# Altium schematic sheet Expansor_conn.SchDoc
size A4; SheetNumber: 1; SheetTotal: 1
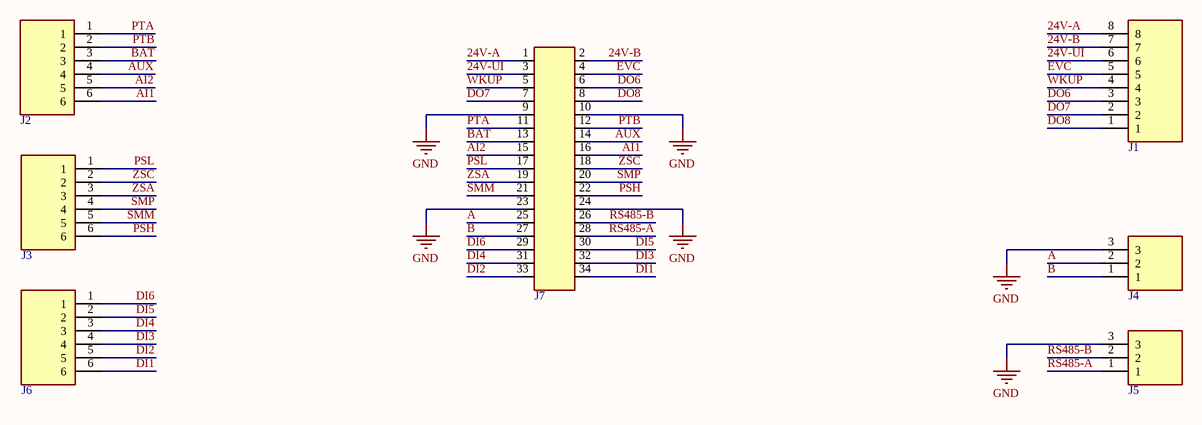
[diagram p0: Expansor_conn.SchDoc]

## Parts
J1  HDRF8  [HDR_F_1X8]  (value not drawn)
J2  HDRF6  [HDR_F_1X6]  (value not drawn)
J3  HDRF6  [HDR_F_1X6]  (value not drawn)
J4  HDRF3  [HDR_F_1X3]  (value not drawn)
J5  HDRF3  [HDR_F_1X3]  (value not drawn)
J6  HDRF6  [HDR_F_1X6]  (value not drawn)
J7  6120XX21621_61203421621  [61203421621]  (value not drawn)

## Nets
GND: J4.3 J5.3 J7.9 J7.10 J7.23 J7.24
24V-A: J1.8 J7.1
24V-B: J1.7 J7.2
24V-UI: J1.6 J7.3
A: J4.2 J7.25
AI1: J2.6 J7.16
AI2: J2.5 J7.15
AUX: J2.4 J7.14
B: J4.1 J7.27
BAT: J2.3 J7.13
DI1: J6.6 J7.34
DI2: J6.5 J7.33
DI3: J6.4 J7.32
DI4: J6.3 J7.31
DI5: J6.2 J7.30
DI6: J6.1 J7.29
DO6: J1.3 J7.6
DO7: J1.2 J7.7
DO8: J1.1 J7.8
EVC: J1.5 J7.4
PSH: J3.6 J7.22
PSL: J3.1 J7.17
PTA: J2.1 J7.11
PTB: J2.2 J7.12
RS485-A: J5.1 J7.28
RS485-B: J5.2 J7.26
SMM: J3.5 J7.21
SMP: J3.4 J7.20
WKUP: J1.4 J7.5
ZSA: J3.3 J7.19
ZSC: J3.2 J7.18

## Library data of the parts
J1 = Header Female 1x8 THT: CONN, HEADER, Female, pitch: 2.54mm, 8POS; VALUE: HDRF8
J2 J3 J6 = Header Female 1x6 THT: CONN, HEADER, Female, pitch: 2.54mm, 6POS; VALUE: HDRF6
J4 J5 = Header Female 1x3 THT: CONN, HEADER, Female, pitch: 2.54mm, 3POS; VALUE: HDRF3
J7 = 6120XX21621_61203421621: 34 pins, straight, gold plating; MF: Wurth Electronics; SnapEDA_Link: https://www.snapeda.com/parts/61203421621/Wurth+Electronics/view-part/?ref=snap; Package: None; Value: *; MP: 61203421621; Check_prices: https://www.snapeda.com/parts/61203421621/Wurth+Electronics/view-part/?ref=eda